# Altium schematic sheet Schematics.SchDoc
size A4; SheetNumber: 1; SheetTotal: 1
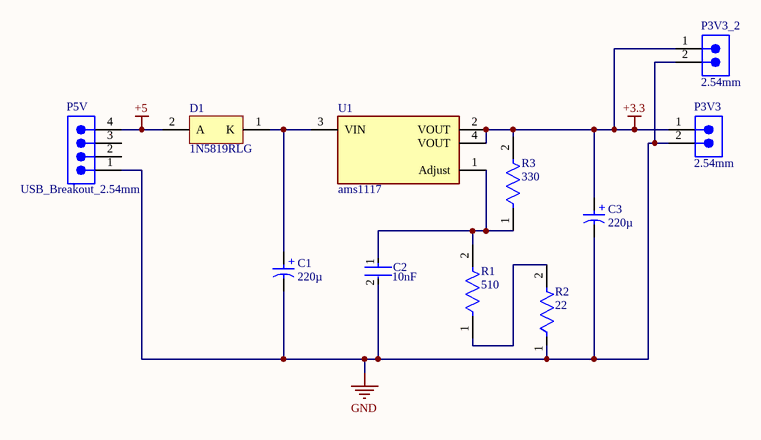
[diagram p0: Schematics.SchDoc]

## Parts
C1  220µ  [WCAP-ATUL_D10H25]
C2  10nF  [FP-C0805C-DN-MFG]
C3  220µ  [WCAP-ATUL_D10H25]
D1  1N5819RLG  [ONSC-AXIAL_LEAD-2-59-10_P]
P3V3  2.54mm  [61300211121]
P3V3_2  2.54mm  [61300211121]
P5V  USB_Breakout_2.54mm  [61300411121]
R1  510  [FP-MRS25-MFG]
R2  22  [FP-MRS25-MFG]
R3  330  [FP-MRS25-MFG]
U1  ams1117  [FP-ams1117-IPC_C]

## Nets
+3.3: C3.1(P) P3V3.1 P3V3_2.1 R3.2 U1.2(VOUT) U1.4(VOUT)
+5: D1.2(A) P5V.4
GND: C1.2(N) C2.2 C3.2(N) P3V3.2 P3V3_2.2 P5V.1 R2.1
NetC1_1: C1.1(P) D1.1(K) U1.3(VIN)
NetC2_1: C2.1 R1.2 R3.1 U1.1(Adjust)
NetR1_1: R1.1 R2.2

Not connected (* = marked no-connect by the designer): P5V 2 3

## Notes on the sheet
- (in symbol CMP-03913-54202247-1) +

## Library data of the parts
C1 C3 = CMP-03913-54202247-1: 860040775010 Alum. Electrolytic Cap 220µF 63V 10mm Radial WCAP-ATUL; Lifetime 7000h +105°C; Life (Hours): 7000hours; Impedance: 185mΩ; Leakage Current: 138.6µA; Material: Aluminium; Pitch: 5mm; Ripple Current: 1.1A; Tolerance: 20%; Polarity: Polar; Diameter: 10mm; REACH SVHC: Unknown; Voltage Rating: 63V; Length: 25mm; Packaging: Tape & Box (TB); Min Operating Temperature: -40°C; Height: 25mm; Voltage Rating (DC): 63V; RoHS: Compliant; Height - Seated (Max): 26.4922mm; Mount: Through Hole; Lead Pitch: 5.0038mm; Case/Package: Radial; NexarPartId: 54202247; Capacitance: 220µF; Max Operating Temperature: 105°C
C2 = CMP-2007-00259-2: CAP CER 10000PF 200V X7R 0805; Manufacturer Part Number: C0805C103K2RACTU; Manufacturer: KEMET; Material: Ceramic; Temperature Coefficient: 30ppm/°C; Capacitance: 10,000 pF; Tolerance: 0.1; Value: 10,000 pF; Device Class L2: Capacitors; Voltage Rating: 200 V; Temperature Range High: +125°C; ComponentLink2Description: Datasheet; Height: 0.88mm; Octopart: https://octopart.com/c0805c103k2ractu-kemet-9138347; ComponentLink2URL: https://content.kemet.com/datasheets/KEM_C1003_C0G_SMD.pdf; Category: Cap; Temperature: -55°C to +125°C; Temperature Range Low: -55°C; Digikey Description: CAP CER 10000PF 200V X7R 0805; Temperature Characteristic: X7R; Automotive: No; Device Class L3: Ceramic Capacitors; Mouser Description: KEMET - C0805C103K2RACTU - CAP, MLCC, X7R, 10NF, 200V, 0805; RoHS: TRUE; Device Class L1: Passive Components; Lead Free: Yes; Package: C0805C-DN; Ipc Land Pattern Name: CAPC200125X78
D1 = CMP-1055-00037-1: Rectifier, 2-Pin Axial_Lead, Pb-Free, Tape and Reel; Manufacturer: On Semiconductor; IFSM Max (A): 25; Configuration: Single; ComponentLink1Description: Manufacturer URL; PackageReference: AXIAL_LEAD-2-59-10; RoHS: TRUE; PackageVersion: Rev. U, 02/2005; Mounting Technology: Through Hole; ComponentLink3URL: http://www.onsemi.cn/pub_link/Collateral/59-10.PDF; ComponentLink3Description: Package Specification; PackageDescription: 2-Pin, Axial Lead, Diameter 2.35 mm; ComponentLink2Description: Datasheet; ComponentLink1URL: http://www.onsemi.com/; Packing: Tape and Reel; DatasheetVersion: Rev. 10; ComponentLink2URL: http://www.onsemi.cn/pub_link/Collateral/1N5817-D.PDF; PartNumber: 1N5819RLG
P3V3 P3V3_2 = CMP-1712-00002-6: NexarPartId: 20081794; Number of Contacts: 2; Connector Type: Male Pin; Voltage Rating: 250V; Current Rating: 3A; Gender: Male; Contact Resistance: 20mΩ; Height: 8.94mm; Lead Free: Lead Free; Number of Pins: 2; Termination: Through Hole; RoHS: Compliant; Lead Pitch: 2.54mm; REACH SVHC: No SVHC; Pitch: 2.54mm; Housing Material: PBT; Contact Mating Length: 5.9944mm; Min Operating Temperature: -40°C; Orientation: Vertical; Contact Material: Copper; Contact Gender: Male; Max Operating Temperature: 125°C; Number of Rows: 1; Number of Positions: 2; Packaging: Bulk; Contact Plating: Gold; Mount: Through Hole; Color: Black; Operating Supply Voltage: 250V
P5V = CMP-1502-01064-3: NexarPartId: 32855522; Operating Supply Voltage: 250V; Pitch: 2.54mm; Contact Resistance: 20mΩ; Number of Positions: 4; Current Rating: 3A; Connector Type: Male Pin; Gender: Male; Contact Plating: Gold; Height: 8.89mm; Lead Pitch: 2.54mm; Lead Free: Lead Free; Contact Mating Length: 5.9944mm; Number of Rows: 1; Termination: Solder; Packaging: Bulk; REACH SVHC: Unknown; Min Operating Temperature: -40°C; RoHS: Compliant; Number of Contacts: 4; Voltage Rating: 250V; Color: Black; Max Operating Temperature: 105°C; Contact Material: Copper; Mount: Through Hole; Orientation: Vertical; Number of Pins: 4
R1-R3 = CMP-00030-42757237-1: MRS25000C1000FRP00 Resistor,  ± 1%, 600 mW, Axial Leaded, Metal Film (Thin Film), Professional; Max Power Dissipation: 600mW; Resistance: 100Ω; Voltage Rating: 350V; Temperature Coefficient: 50ppm/°C; Lead Diameter: 600µm; RoHS: Compliant; Radiation Hardening: No; Schedule B: 8533210090, 8533210090; Length: 6.5mm; Packaging: Tape & Reel (TR); Number of Terminations: 2; Mount: Through Hole; Width: 2.5mm; Tolerance: 1%; Military Standard: Not; Voltage Rating (DC): 350V; Contact Plating: Tin; Number of Pins: 2; Max Operating Temperature: 155°C; NexarPartId: 42757237; Diameter: 2.5mm; Composition: Metal Film, Thin Film; REACH SVHC: Unknown; Power Rating: 600mW; Lead Free: Lead Free; Termination: Axial; Case/Package: Axial; Min Operating Temperature: -55°C
U1 = CMP-209535-000002-1: 1A LOW DROPOUT VOLTAGE REGULATOR; RoHS Compliant: Yes